# EAGLE schematic proto (EAGLE 6.6.0), part 1 of 2

## Sheet 1 of 3
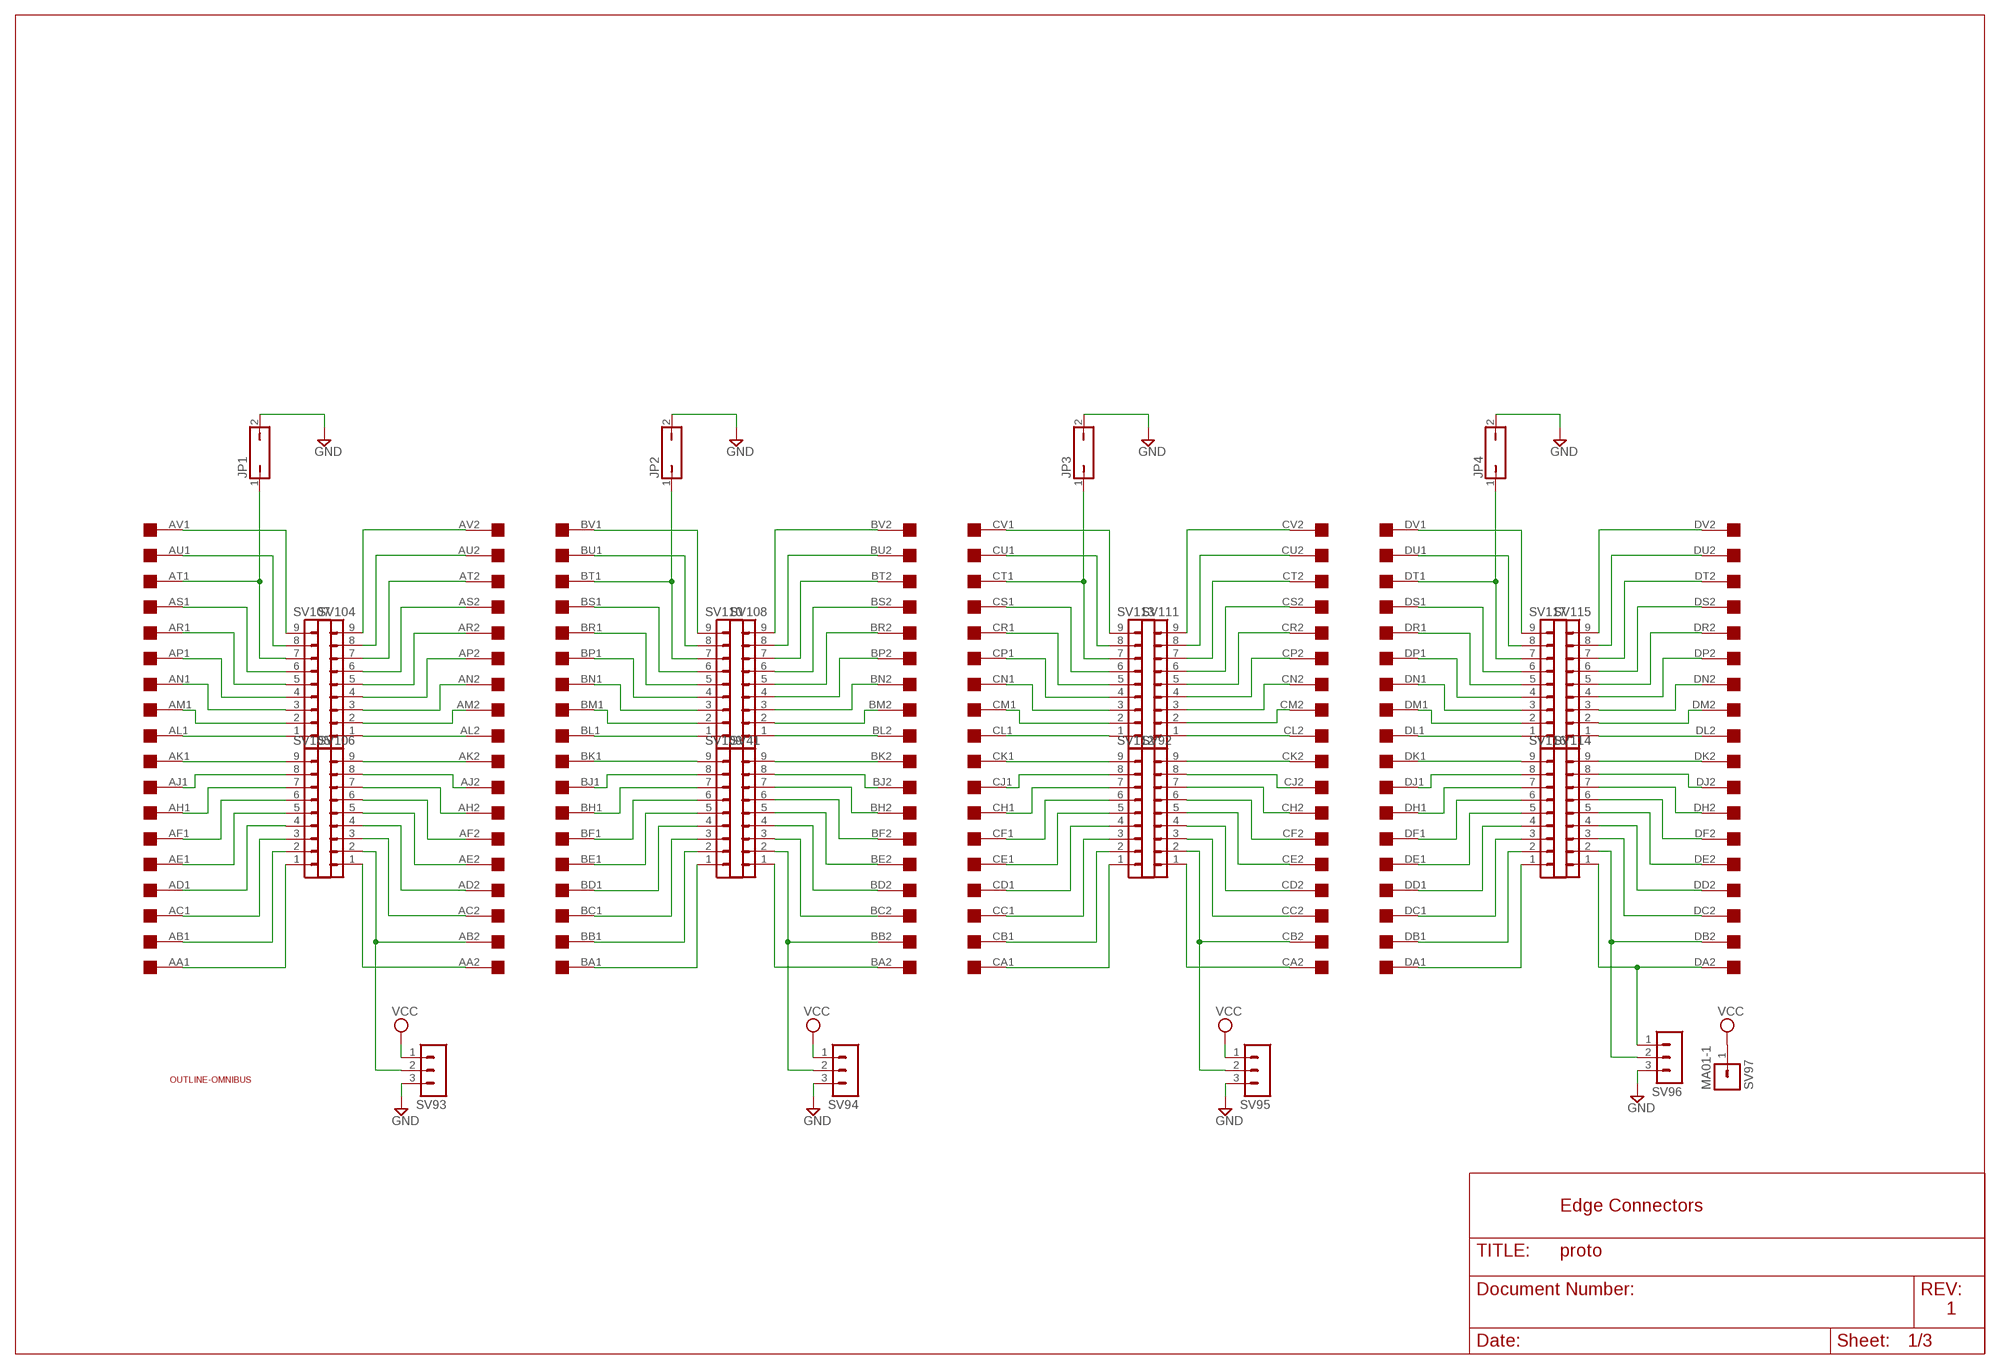
[diagram p0: schematic, sheet 1]

### Parts
JP1  JP1Q  [JP1]
JP2  JP1Q  [JP1]
JP3  JP1Q  [JP1]
JP4  JP1Q  [JP1]
SV41  MA09-1  [MA09-1]
SV92  MA09-1  [MA09-1]
SV93  MA03-1  [MA03-1]
SV94  MA03-1  [MA03-1]
SV95  MA03-1  [MA03-1]
SV96  MA03-1  [MA03-1]
SV97  MA01-1  [MA01-1]
SV104  MA09-1  [MA09-1]
SV105  MA09-1  [MA09-1]
SV106  MA09-1  [MA09-1]
SV107  MA09-1  [MA09-1]
SV108  MA09-1  [MA09-1]
SV109  MA09-1  [MA09-1]
SV110  MA09-1  [MA09-1]
SV111  MA09-1  [MA09-1]
SV112  MA09-1  [MA09-1]
SV113  MA09-1  [MA09-1]
SV114  MA09-1  [MA09-1]
SV115  MA09-1  [MA09-1]
SV116  MA09-1  [MA09-1]
SV117  MA09-1  [MA09-1]
U$1  OUTLINE-OMNIBUS  [OMNIBUS]
U$2  QUAD  [EDGE-CON8]

### Nets
GND [supply]: JP1.2 JP2.2 JP3.2 JP4.2 SV93.3 SV94.3 SV95.3 SV96.3 ; also sheet 2,3
N$46: SV106.1 U$2.AA2
N$47: SV93.2 SV106.2 U$2.AB2
N$48: SV109.9 U$2.BK1
N$49: SV41.9 U$2.BK2
N$50: SV112.9 U$2.CK1
N$51: SV41.1 U$2.BA2
N$52: SV116.9 U$2.DK1
N$53: SV112.1 U$2.CA1
N$54: SV116.1 U$2.DA1
N$1227: SV106.3 U$2.AC2
N$1228: SV104.9 U$2.AV2
N$1229: SV104.8 U$2.AU2
N$1230: SV104.7 U$2.AT2
N$1231: SV104.6 U$2.AS2
N$1232: SV104.5 U$2.AR2
N$1233: SV104.4 U$2.AP2
N$1234: SV106.4 U$2.AD2
N$1235: SV106.5 U$2.AE2
N$1236: SV106.6 U$2.AF2
N$1237: SV106.7 U$2.AH2
N$1238: SV104.3 U$2.AN2
N$1239: SV106.8 U$2.AJ2
N$1240: SV106.9 U$2.AK2
N$1241: SV104.1 U$2.AL2
N$1242: SV104.2 U$2.AM2
N$1243: SV105.1 U$2.AA1
N$1244: SV105.2 U$2.AB1
N$1245: SV105.3 U$2.AC1
N$1246: SV105.4 U$2.AD1
N$1247: SV105.5 U$2.AE1
N$1248: SV105.6 U$2.AF1
N$1249: SV105.7 U$2.AH1
N$1250: SV105.8 U$2.AJ1
N$1251: SV105.9 U$2.AK1
N$1252: SV107.1 U$2.AL1
N$1253: SV107.2 U$2.AM1
N$1254: SV107.3 U$2.AN1
N$1255: SV107.4 U$2.AP1
N$1256: SV107.5 U$2.AR1
N$1257: SV107.6 U$2.AS1
N$1258: JP1.1 SV107.7 U$2.AT1
N$1259: SV107.8 U$2.AU1
N$1260: SV107.9 U$2.AV1
N$1261: SV41.2 SV94.2 U$2.BB2
N$1262: SV41.3 U$2.BC2
N$1263: SV41.4 U$2.BD2
N$1264: SV41.5 U$2.BE2
N$1265: SV41.6 U$2.BF2
N$1266: SV41.7 U$2.BH2
N$1267: SV41.8 U$2.BJ2
N$1268: SV108.1 U$2.BL2
N$1269: SV108.2 U$2.BM2
N$1270: SV108.3 U$2.BN2
N$1271: SV108.4 U$2.BP2
N$1272: SV108.5 U$2.BR2
N$1273: SV108.6 U$2.BS2
N$1274: SV108.9 U$2.BV2
N$1275: SV108.8 U$2.BU2
N$1276: SV108.7 U$2.BT2
N$1277: SV109.1 U$2.BA1
N$1278: SV109.2 U$2.BB1
N$1279: SV109.3 U$2.BC1
N$1280: SV109.4 U$2.BD1
N$1281: SV109.5 U$2.BE1
N$1282: SV109.6 U$2.BF1
N$1283: SV109.7 U$2.BH1
N$1284: SV109.8 U$2.BJ1
N$1285: SV110.1 U$2.BL1
N$1286: SV110.2 U$2.BM1
N$1287: SV110.3 U$2.BN1
N$1288: SV110.4 U$2.BP1
N$1289: SV110.5 U$2.BR1
N$1290: SV110.6 U$2.BS1
N$1291: JP2.1 SV110.7 U$2.BT1
N$1292: SV110.8 U$2.BU1
N$1293: SV110.9 U$2.BV1
N$1294: SV116.2 U$2.DB1
N$1295: SV116.3 U$2.DC1
N$1296: SV116.4 U$2.DD1
N$1297: SV116.5 U$2.DE1
N$1298: SV116.6 U$2.DF1
N$1299: SV116.7 U$2.DH1
N$1300: SV116.8 U$2.DJ1
N$1301: SV117.1 U$2.DL1
N$1302: SV117.2 U$2.DM1
N$1303: SV117.3 U$2.DN1
N$1304: SV117.4 U$2.DP1
N$1305: SV117.5 U$2.DR1
N$1306: SV117.6 U$2.DS1
N$1307: JP4.1 SV117.7 U$2.DT1
N$1308: SV117.8 U$2.DU1
N$1309: SV117.9 U$2.DV1
N$1310: SV112.2 U$2.CB1
N$1311: SV112.3 U$2.CC1
N$1312: SV112.4 U$2.CD1
N$1313: SV112.5 U$2.CE1
N$1314: SV112.6 U$2.CF1
N$1315: SV112.7 U$2.CH1
N$1316: SV112.8 U$2.CJ1
N$1317: SV113.1 U$2.CL1
N$1318: SV113.2 U$2.CM1
N$1319: SV113.3 U$2.CN1
N$1320: SV113.4 U$2.CP1
N$1321: SV113.5 U$2.CR1
N$1322: SV113.6 U$2.CS1
N$1323: JP3.1 SV113.7 U$2.CT1
N$1324: SV113.8 U$2.CU1
N$1325: SV113.9 U$2.CV1
N$1326: SV92.1 U$2.CA2
N$1327: SV96.2 SV114.2 U$2.DB2
N$1328: SV92.3 U$2.CC2
N$1329: SV92.4 U$2.CD2
N$1330: SV92.5 U$2.CE2
N$1331: SV92.6 U$2.CF2
N$1332: SV92.7 U$2.CH2
N$1333: SV92.8 U$2.CJ2
N$1334: SV92.9 U$2.CK2
N$1335: SV114.9 U$2.DK2
N$1336: SV111.1 U$2.CL2
N$1337: SV111.2 U$2.CM2
N$1338: SV111.3 U$2.CN2
N$1339: SV111.4 U$2.CP2
N$1340: SV111.5 U$2.CR2
N$1341: SV111.6 U$2.CS2
N$1342: SV111.7 U$2.CT2
N$1343: SV111.8 U$2.CU2
N$1344: SV111.9 U$2.CV2
N$1345: SV115.9 U$2.DV2
N$1346: SV96.1 SV114.1 U$2.DA2
N$1348: SV114.3 U$2.DC2
N$1349: SV114.4 U$2.DD2
N$1350: SV114.5 U$2.DE2
N$1351: SV114.6 U$2.DF2
N$1352: SV114.7 U$2.DH2
N$1353: SV114.8 U$2.DJ2
N$1354: SV115.1 U$2.DL2
N$1355: SV115.2 U$2.DM2
N$1356: SV115.3 U$2.DN2
N$1357: SV115.4 U$2.DP2
N$1358: SV115.5 U$2.DR2
N$1359: SV115.6 U$2.DS2
N$1360: SV115.7 U$2.DT2
N$1361: SV115.8 U$2.DU2
N$1362: SV92.2 SV95.2 U$2.CB2
VCC [supply]: SV93.1 SV94.1 SV95.1 SV97.1 ; also sheet 2,3

### Notes on the sheet
- Edge Connectors
- 1

## Sheet 2 of 3
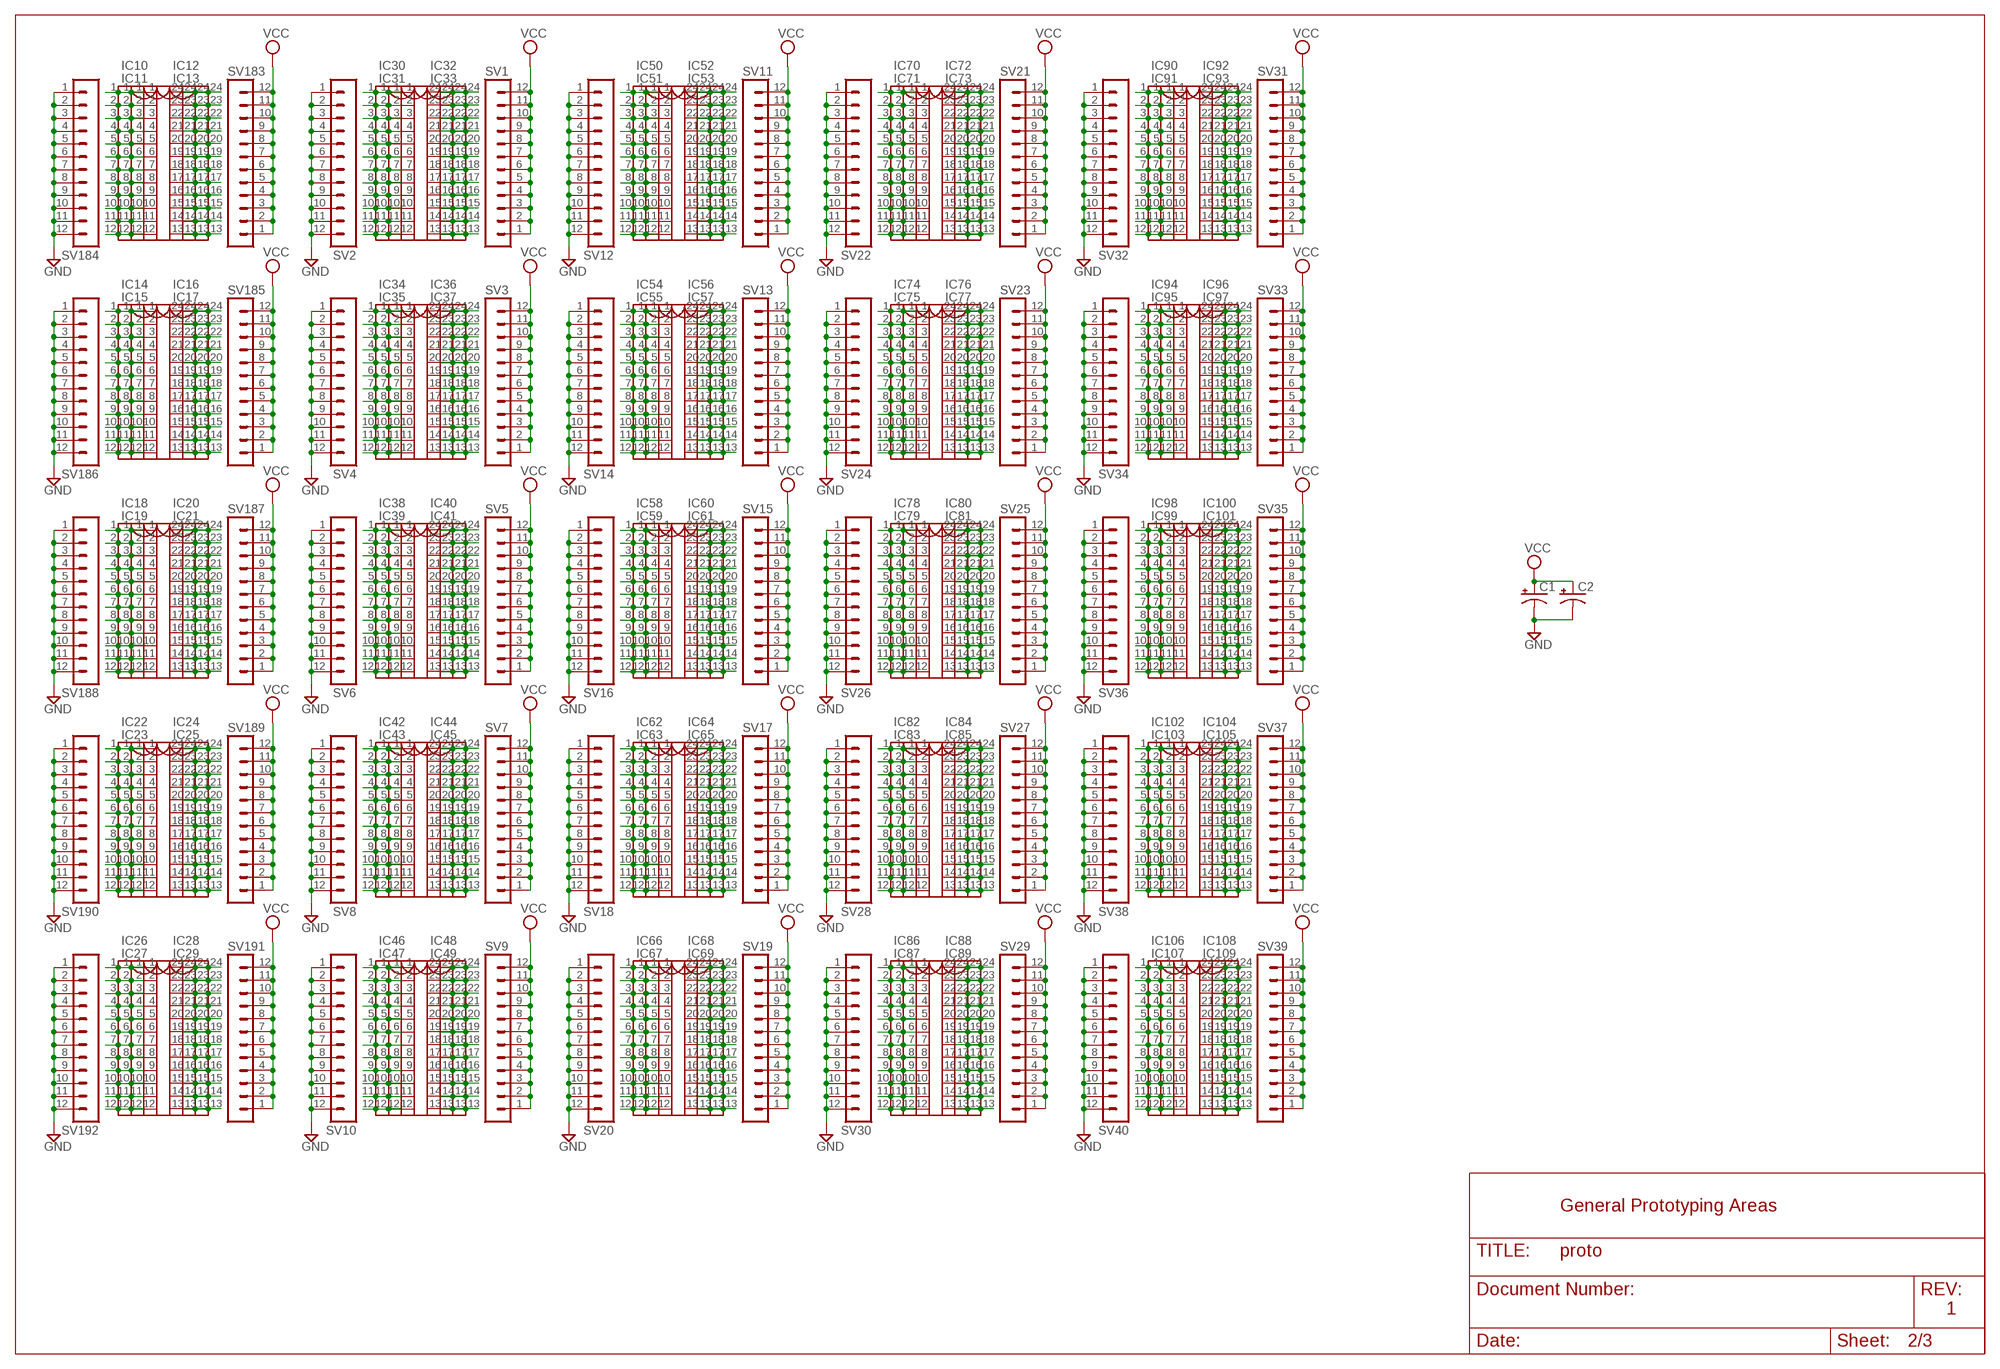
[diagram p1: schematic, sheet 2]

### Parts
C1  CPOL-USE20-8AXIAL  [E12-8]
C2  CPOL-USE20-8AXIAL  [E12-8]
IC10  DIL24-3  [DIL24-3]
IC11  DIL24-6  [DIL24-6]
IC12  DIL24-9  [DIL24-9]
IC13  DIL24-6  [DIL24-6]
IC14  DIL24-3  [DIL24-3]
IC15  DIL24-6  [DIL24-6]
IC16  DIL24-9  [DIL24-9]
IC17  DIL24-6  [DIL24-6]
IC18  DIL24-3  [DIL24-3]
IC19  DIL24-6  [DIL24-6]
IC20  DIL24-9  [DIL24-9]
IC21  DIL24-6  [DIL24-6]
IC22  DIL24-3  [DIL24-3]
IC23  DIL24-6  [DIL24-6]
IC24  DIL24-9  [DIL24-9]
IC25  DIL24-6  [DIL24-6]
IC26  DIL24-3  [DIL24-3]
IC27  DIL24-6  [DIL24-6]
IC28  DIL24-9  [DIL24-9]
IC29  DIL24-6  [DIL24-6]
IC30  DIL24-3  [DIL24-3]
IC31  DIL24-6  [DIL24-6]
IC32  DIL24-9  [DIL24-9]
IC33  DIL24-6  [DIL24-6]
IC34  DIL24-3  [DIL24-3]
IC35  DIL24-6  [DIL24-6]
IC36  DIL24-9  [DIL24-9]
IC37  DIL24-6  [DIL24-6]
IC38  DIL24-3  [DIL24-3]
IC39  DIL24-6  [DIL24-6]
IC40  DIL24-9  [DIL24-9]
IC41  DIL24-6  [DIL24-6]
IC42  DIL24-3  [DIL24-3]
IC43  DIL24-6  [DIL24-6]
IC44  DIL24-9  [DIL24-9]
IC45  DIL24-6  [DIL24-6]
IC46  DIL24-3  [DIL24-3]
IC47  DIL24-6  [DIL24-6]
IC48  DIL24-9  [DIL24-9]
IC49  DIL24-6  [DIL24-6]
IC50  DIL24-3  [DIL24-3]
IC51  DIL24-6  [DIL24-6]
IC52  DIL24-9  [DIL24-9]
IC53  DIL24-6  [DIL24-6]
IC54  DIL24-3  [DIL24-3]
IC55  DIL24-6  [DIL24-6]
IC56  DIL24-9  [DIL24-9]
IC57  DIL24-6  [DIL24-6]
IC58  DIL24-3  [DIL24-3]
IC59  DIL24-6  [DIL24-6]
IC60  DIL24-9  [DIL24-9]
IC61  DIL24-6  [DIL24-6]
IC62  DIL24-3  [DIL24-3]
IC63  DIL24-6  [DIL24-6]
IC64  DIL24-9  [DIL24-9]
IC65  DIL24-6  [DIL24-6]
IC66  DIL24-3  [DIL24-3]
IC67  DIL24-6  [DIL24-6]
IC68  DIL24-9  [DIL24-9]
IC69  DIL24-6  [DIL24-6]
IC70  DIL24-3  [DIL24-3]
IC71  DIL24-6  [DIL24-6]
IC72  DIL24-9  [DIL24-9]
IC73  DIL24-6  [DIL24-6]
IC74  DIL24-3  [DIL24-3]
IC75  DIL24-6  [DIL24-6]
IC76  DIL24-9  [DIL24-9]
IC77  DIL24-6  [DIL24-6]
IC78  DIL24-3  [DIL24-3]
IC79  DIL24-6  [DIL24-6]
IC80  DIL24-9  [DIL24-9]
IC81  DIL24-6  [DIL24-6]
IC82  DIL24-3  [DIL24-3]
IC83  DIL24-6  [DIL24-6]
IC84  DIL24-9  [DIL24-9]
IC85  DIL24-6  [DIL24-6]
IC86  DIL24-3  [DIL24-3]
IC87  DIL24-6  [DIL24-6]
IC88  DIL24-9  [DIL24-9]
IC89  DIL24-6  [DIL24-6]
IC90  DIL24-3  [DIL24-3]
IC91  DIL24-6  [DIL24-6]
IC92  DIL24-9  [DIL24-9]
IC93  DIL24-6  [DIL24-6]
IC94  DIL24-3  [DIL24-3]
IC95  DIL24-6  [DIL24-6]
IC96  DIL24-9  [DIL24-9]
IC97  DIL24-6  [DIL24-6]
IC98  DIL24-3  [DIL24-3]
IC99  DIL24-6  [DIL24-6]
IC100  DIL24-9  [DIL24-9]
IC101  DIL24-6  [DIL24-6]
IC102  DIL24-3  [DIL24-3]
IC103  DIL24-6  [DIL24-6]
IC104  DIL24-9  [DIL24-9]
IC105  DIL24-6  [DIL24-6]
IC106  DIL24-3  [DIL24-3]
IC107  DIL24-6  [DIL24-6]
IC108  DIL24-9  [DIL24-9]
IC109  DIL24-6  [DIL24-6]
SV1  MA12-1  [MA12-1]
SV2  MA12-1  [MA12-1]
SV3  MA12-1  [MA12-1]
SV4  MA12-1  [MA12-1]
SV5  MA12-1  [MA12-1]
SV6  MA12-1  [MA12-1]
SV7  MA12-1  [MA12-1]
SV8  MA12-1  [MA12-1]
SV9  MA12-1  [MA12-1]
SV10  MA12-1  [MA12-1]
SV11  MA12-1  [MA12-1]
SV12  MA12-1  [MA12-1]
SV13  MA12-1  [MA12-1]
SV14  MA12-1  [MA12-1]
SV15  MA12-1  [MA12-1]
SV16  MA12-1  [MA12-1]
SV17  MA12-1  [MA12-1]
SV18  MA12-1  [MA12-1]
SV19  MA12-1  [MA12-1]
SV20  MA12-1  [MA12-1]
SV21  MA12-1  [MA12-1]
SV22  MA12-1  [MA12-1]
SV23  MA12-1  [MA12-1]
SV24  MA12-1  [MA12-1]
SV25  MA12-1  [MA12-1]
SV26  MA12-1  [MA12-1]
SV27  MA12-1  [MA12-1]
SV28  MA12-1  [MA12-1]
SV29  MA12-1  [MA12-1]
SV30  MA12-1  [MA12-1]
SV31  MA12-1  [MA12-1]
SV32  MA12-1  [MA12-1]
SV33  MA12-1  [MA12-1]
SV34  MA12-1  [MA12-1]
SV35  MA12-1  [MA12-1]
SV36  MA12-1  [MA12-1]
SV37  MA12-1  [MA12-1]
SV38  MA12-1  [MA12-1]
SV39  MA12-1  [MA12-1]
SV40  MA12-1  [MA12-1]
SV183  MA12-1  [MA12-1]
SV184  MA12-1  [MA12-1]
SV185  MA12-1  [MA12-1]
SV186  MA12-1  [MA12-1]
SV187  MA12-1  [MA12-1]
SV188  MA12-1  [MA12-1]
SV189  MA12-1  [MA12-1]
SV190  MA12-1  [MA12-1]
SV191  MA12-1  [MA12-1]
SV192  MA12-1  [MA12-1]

### Nets
GND [supply]: C1.- C2.- SV2.1 SV2.2 SV2.3 SV2.4 SV2.5 SV2.6 SV2.7 SV2.8 SV2.9 SV2.10 SV2.11 SV2.12 SV4.1 SV4.2 SV4.3 SV4.4 SV4.5 SV4.6 SV4.7 SV4.8 SV4.9 SV4.10 SV4.11 SV4.12 SV6.1 SV6.2 SV6.3 SV6.4 SV6.5 SV6.6 SV6.7 SV6.8 SV6.9 SV6.10 SV6.11 SV6.12 SV8.1 SV8.2 SV8.3 SV8.4 SV8.5 SV8.6 SV8.7 SV8.8 SV8.9 SV8.10 SV8.11 SV8.12 SV10.1 SV10.2 SV10.3 SV10.4 SV10.5 SV10.6 SV10.7 SV10.8 SV10.9 SV10.10 SV10.11 SV10.12 SV12.1 SV12.2 SV12.3 SV12.4 SV12.5 SV12.6 SV12.7 SV12.8 SV12.9 SV12.10 SV12.11 SV12.12 SV14.1 SV14.2 SV14.3 SV14.4 SV14.5 SV14.6 SV14.7 SV14.8 SV14.9 SV14.10 SV14.11 SV14.12 SV16.1 SV16.2 SV16.3 SV16.4 SV16.5 SV16.6 SV16.7 SV16.8 SV16.9 SV16.10 SV16.11 SV16.12 SV18.1 SV18.2 SV18.3 SV18.4 SV18.5 SV18.6 SV18.7 SV18.8 SV18.9 SV18.10 SV18.11 SV18.12 SV20.1 SV20.2 SV20.3 SV20.4 SV20.5 SV20.6 SV20.7 SV20.8 SV20.9 SV20.10 SV20.11 SV20.12 SV22.1 SV22.2 SV22.3 SV22.4 SV22.5 SV22.6 SV22.7 SV22.8 SV22.9 SV22.10 SV22.11 SV22.12 SV24.1 SV24.2 SV24.3 SV24.4 SV24.5 SV24.6 SV24.7 SV24.8 SV24.9 SV24.10 SV24.11 SV24.12 SV26.1 SV26.2 SV26.3 SV26.4 SV26.5 SV26.6 SV26.7 SV26.8 SV26.9 SV26.10 SV26.11 SV26.12 SV28.1 SV28.2 SV28.3 SV28.4 SV28.5 SV28.6 SV28.7 SV28.8 SV28.9 SV28.10 SV28.11 SV28.12 SV30.1 SV30.2 SV30.3 SV30.4 SV30.5 SV30.6 SV30.7 SV30.8 SV30.9 SV30.10 SV30.11 SV30.12 SV32.1 SV32.2 SV32.3 SV32.4 SV32.5 SV32.6 SV32.7 SV32.8 SV32.9 SV32.10 SV32.11 SV32.12 SV34.1 SV34.2 SV34.3 SV34.4 SV34.5 SV34.6 SV34.7 SV34.8 SV34.9 SV34.10 SV34.11 SV34.12 SV36.1 SV36.2 SV36.3 SV36.4 SV36.5 SV36.6 SV36.7 SV36.8 SV36.9 SV36.10 SV36.11 SV36.12 SV38.1 SV38.2 SV38.3 SV38.4 SV38.5 SV38.6 SV38.7 SV38.8 SV38.9 SV38.10 SV38.11 SV38.12 SV40.1 SV40.2 SV40.3 SV40.4 SV40.5 SV40.6 SV40.7 SV40.8 SV40.9 SV40.10 SV40.11 SV40.12 SV184.1 SV184.2 SV184.3 SV184.4 SV184.5 SV184.6 SV184.7 SV184.8 SV184.9 SV184.10 SV184.11 SV184.12 SV186.1 SV186.2 SV186.3 SV186.4 SV186.5 SV186.6 SV186.7 SV186.8 SV186.9 SV186.10 SV186.11 SV186.12 SV188.1 SV188.2 SV188.3 SV188.4 SV188.5 SV188.6 SV188.7 SV188.8 SV188.9 SV188.10 SV188.11 SV188.12 SV190.1 SV190.2 SV190.3 SV190.4 SV190.5 SV190.6 SV190.7 SV190.8 SV190.9 SV190.10 SV190.11 SV190.12 SV192.1 SV192.2 SV192.3 SV192.4 SV192.5 SV192.6 SV192.7 SV192.8 SV192.9 SV192.10 SV192.11 SV192.12 ; also sheet 1,3
N$34: IC30.1 IC31.1 IC32.1 IC33.1
N$40: IC30.2 IC31.2 IC32.2 IC33.2
N$41: IC30.3 IC31.3 IC32.3 IC33.3
N$42: IC30.4 IC31.4 IC32.4 IC33.4
N$43: IC30.5 IC31.5 IC32.5 IC33.5
N$44: IC30.6 IC31.6 IC32.6 IC33.6
N$45: IC30.7 IC31.7 IC32.7 IC33.7
N$55: IC10.1 IC11.1 IC12.1 IC13.1
N$56: IC10.2 IC11.2 IC12.2 IC13.2
N$57: IC10.3 IC11.3 IC12.3 IC13.3
N$58: IC10.4 IC11.4 IC12.4 IC13.4
N$59: IC10.5 IC11.5 IC12.5 IC13.5
N$60: IC10.6 IC11.6 IC12.6 IC13.6
N$61: IC10.7 IC11.7 IC12.7 IC13.7
N$62: IC10.8 IC11.8 IC12.8 IC13.8
N$63: IC10.9 IC11.9 IC12.9 IC13.9
N$64: IC10.10 IC11.10 IC12.10 IC13.10
N$65: IC10.11 IC11.11 IC12.11 IC13.11
N$66: IC10.12 IC11.12 IC12.12 IC13.12
N$67: IC10.13 IC11.13 IC12.13 IC13.13
N$68: IC10.14 IC11.14 IC12.14 IC13.14
N$69: IC10.15 IC11.15 IC12.15 IC13.15
N$70: IC10.16 IC11.16 IC12.16 IC13.16
N$71: IC10.17 IC11.17 IC12.17 IC13.17
N$72: IC10.18 IC11.18 IC12.18 IC13.18
N$73: IC10.19 IC11.19 IC12.19 IC13.19
N$74: IC10.20 IC11.20 IC12.20 IC13.20
N$75: IC10.21 IC11.21 IC12.21 IC13.21
N$76: IC10.22 IC11.22 IC12.22 IC13.22
N$77: IC10.23 IC11.23 IC12.23 IC13.23
N$78: IC10.24 IC11.24 IC12.24 IC13.24
N$79: IC14.1 IC15.1 IC16.1 IC17.1
N$80: IC14.2 IC15.2 IC16.2 IC17.2
N$81: IC14.3 IC15.3 IC16.3 IC17.3
N$82: IC14.4 IC15.4 IC16.4 IC17.4
N$83: IC14.5 IC15.5 IC16.5 IC17.5
N$84: IC14.6 IC15.6 IC16.6 IC17.6
N$85: IC14.7 IC15.7 IC16.7 IC17.7
N$86: IC14.8 IC15.8 IC16.8 IC17.8
N$87: IC14.9 IC15.9 IC16.9 IC17.9
N$88: IC14.10 IC15.10 IC16.10 IC17.10
N$89: IC14.11 IC15.11 IC16.11 IC17.11
N$90: IC14.12 IC15.12 IC16.12 IC17.12
N$91: IC14.13 IC15.13 IC16.13 IC17.13
N$92: IC14.14 IC15.14 IC16.14 IC17.14
N$93: IC14.15 IC15.15 IC16.15 IC17.15
N$94: IC14.16 IC15.16 IC16.16 IC17.16
N$95: IC14.17 IC15.17 IC16.17 IC17.17
N$96: IC14.18 IC15.18 IC16.18 IC17.18
N$97: IC14.19 IC15.19 IC16.19 IC17.19
N$98: IC14.20 IC15.20 IC16.20 IC17.20
N$99: IC14.21 IC15.21 IC16.21 IC17.21
N$100: IC14.22 IC15.22 IC16.22 IC17.22
N$101: IC14.23 IC15.23 IC16.23 IC17.23
N$102: IC14.24 IC15.24 IC16.24 IC17.24
N$103: IC18.1 IC19.1 IC20.1 IC21.1
N$104: IC18.2 IC19.2 IC20.2 IC21.2
N$105: IC18.3 IC19.3 IC20.3 IC21.3
N$106: IC18.4 IC19.4 IC20.4 IC21.4
N$107: IC18.5 IC19.5 IC20.5 IC21.5
N$108: IC18.6 IC19.6 IC20.6 IC21.6
N$109: IC18.7 IC19.7 IC20.7 IC21.7
N$110: IC18.8 IC19.8 IC20.8 IC21.8
N$111: IC18.9 IC19.9 IC20.9 IC21.9
N$112: IC18.10 IC19.10 IC20.10 IC21.10
N$113: IC18.11 IC19.11 IC20.11 IC21.11
N$114: IC18.12 IC19.12 IC20.12 IC21.12
N$115: IC18.13 IC19.13 IC20.13 IC21.13
N$116: IC18.14 IC19.14 IC20.14 IC21.14
N$117: IC18.15 IC19.15 IC20.15 IC21.15
N$118: IC18.16 IC19.16 IC20.16 IC21.16
N$119: IC18.17 IC19.17 IC20.17 IC21.17
N$120: IC18.18 IC19.18 IC20.18 IC21.18
N$121: IC18.19 IC19.19 IC20.19 IC21.19
N$122: IC18.20 IC19.20 IC20.20 IC21.20
N$123: IC18.21 IC19.21 IC20.21 IC21.21
N$124: IC18.22 IC19.22 IC20.22 IC21.22
N$125: IC18.23 IC19.23 IC20.23 IC21.23
N$126: IC18.24 IC19.24 IC20.24 IC21.24
N$127: IC22.1 IC23.1 IC24.1 IC25.1
N$128: IC22.2 IC23.2 IC24.2 IC25.2
N$129: IC22.3 IC23.3 IC24.3 IC25.3
N$130: IC22.4 IC23.4 IC24.4 IC25.4
N$131: IC22.5 IC23.5 IC24.5 IC25.5
N$132: IC22.6 IC23.6 IC24.6 IC25.6
N$133: IC22.7 IC23.7 IC24.7 IC25.7
N$134: IC22.8 IC23.8 IC24.8 IC25.8
N$135: IC22.9 IC23.9 IC24.9 IC25.9
N$136: IC22.10 IC23.10 IC24.10 IC25.10
N$137: IC22.11 IC23.11 IC24.11 IC25.11
N$138: IC22.12 IC23.12 IC24.12 IC25.12
N$139: IC22.13 IC23.13 IC24.13 IC25.13
N$140: IC22.14 IC23.14 IC24.14 IC25.14
N$141: IC22.15 IC23.15 IC24.15 IC25.15
N$142: IC22.16 IC23.16 IC24.16 IC25.16
N$143: IC22.17 IC23.17 IC24.17 IC25.17
N$144: IC22.18 IC23.18 IC24.18 IC25.18
N$145: IC22.19 IC23.19 IC24.19 IC25.19
N$146: IC22.20 IC23.20 IC24.20 IC25.20
N$147: IC22.21 IC23.21 IC24.21 IC25.21
N$148: IC22.22 IC23.22 IC24.22 IC25.22
N$149: IC22.23 IC23.23 IC24.23 IC25.23
N$150: IC22.24 IC23.24 IC24.24 IC25.24
N$151: IC26.1 IC27.1 IC28.1 IC29.1
N$152: IC26.2 IC27.2 IC28.2 IC29.2
N$153: IC26.3 IC27.3 IC28.3 IC29.3
N$154: IC26.4 IC27.4 IC28.4 IC29.4
N$155: IC26.5 IC27.5 IC28.5 IC29.5
N$156: IC26.6 IC27.6 IC28.6 IC29.6
N$157: IC26.7 IC27.7 IC28.7 IC29.7
N$158: IC26.8 IC27.8 IC28.8 IC29.8
N$159: IC26.9 IC27.9 IC28.9 IC29.9
N$160: IC26.10 IC27.10 IC28.10 IC29.10
N$161: IC26.11 IC27.11 IC28.11 IC29.11
N$162: IC26.12 IC27.12 IC28.12 IC29.12
N$163: IC26.13 IC27.13 IC28.13 IC29.13
N$164: IC26.14 IC27.14 IC28.14 IC29.14
N$165: IC26.15 IC27.15 IC28.15 IC29.15
N$166: IC26.16 IC27.16 IC28.16 IC29.16
N$167: IC26.17 IC27.17 IC28.17 IC29.17
N$168: IC26.18 IC27.18 IC28.18 IC29.18
N$169: IC26.19 IC27.19 IC28.19 IC29.19
N$170: IC26.20 IC27.20 IC28.20 IC29.20
N$171: IC26.21 IC27.21 IC28.21 IC29.21
N$172: IC26.22 IC27.22 IC28.22 IC29.22
N$173: IC26.23 IC27.23 IC28.23 IC29.23
N$174: IC26.24 IC27.24 IC28.24 IC29.24
N$175: IC30.8 IC31.8 IC32.8 IC33.8
N$176: IC30.9 IC31.9 IC32.9 IC33.9
N$177: IC30.10 IC31.10 IC32.10 IC33.10
N$178: IC30.11 IC31.11 IC32.11 IC33.11
N$179: IC30.12 IC31.12 IC32.12 IC33.12
N$180: IC30.13 IC31.13 IC32.13 IC33.13
N$181: IC30.14 IC31.14 IC32.14 IC33.14
N$182: IC30.15 IC31.15 IC32.15 IC33.15
N$183: IC30.16 IC31.16 IC32.16 IC33.16
N$184: IC30.17 IC31.17 IC32.17 IC33.17
N$185: IC30.18 IC31.18 IC32.18 IC33.18
N$186: IC30.19 IC31.19 IC32.19 IC33.19
N$187: IC30.20 IC31.20 IC32.20 IC33.20
N$188: IC30.21 IC31.21 IC32.21 IC33.21
N$189: IC30.22 IC31.22 IC32.22 IC33.22
N$190: IC30.23 IC31.23 IC32.23 IC33.23
N$191: IC30.24 IC31.24 IC32.24 IC33.24
N$192: IC34.1 IC35.1 IC36.1 IC37.1
N$193: IC34.2 IC35.2 IC36.2 IC37.2
N$194: IC34.3 IC35.3 IC36.3 IC37.3
N$195: IC34.4 IC35.4 IC36.4 IC37.4
N$196: IC34.5 IC35.5 IC36.5 IC37.5
N$197: IC34.6 IC35.6 IC36.6 IC37.6
N$198: IC34.7 IC35.7 IC36.7 IC37.7
N$199: IC34.8 IC35.8 IC36.8 IC37.8
N$200: IC34.9 IC35.9 IC36.9 IC37.9
N$201: IC34.10 IC35.10 IC36.10 IC37.10
N$202: IC34.11 IC35.11 IC36.11 IC37.11
N$203: IC34.12 IC35.12 IC36.12 IC37.12
N$204: IC34.13 IC35.13 IC36.13 IC37.13
N$205: IC34.14 IC35.14 IC36.14 IC37.14
N$206: IC34.15 IC35.15 IC36.15 IC37.15
N$207: IC34.16 IC35.16 IC36.16 IC37.16
N$208: IC34.17 IC35.17 IC36.17 IC37.17
N$209: IC34.18 IC35.18 IC36.18 IC37.18
N$210: IC34.19 IC35.19 IC36.19 IC37.19
N$211: IC34.20 IC35.20 IC36.20 IC37.20
N$212: IC34.21 IC35.21 IC36.21 IC37.21
N$213: IC34.22 IC35.22 IC36.22 IC37.22
N$214: IC34.23 IC35.23 IC36.23 IC37.23
N$215: IC34.24 IC35.24 IC36.24 IC37.24
N$216: IC38.1 IC39.1 IC40.1 IC41.1
N$217: IC38.2 IC39.2 IC40.2 IC41.2
N$218: IC38.3 IC39.3 IC40.3 IC41.3
N$219: IC38.4 IC39.4 IC40.4 IC41.4
N$220: IC38.5 IC39.5 IC40.5 IC41.5
N$221: IC38.6 IC39.6 IC40.6 IC41.6
N$222: IC38.7 IC39.7 IC40.7 IC41.7
N$223: IC38.8 IC39.8 IC40.8 IC41.8
N$224: IC38.9 IC39.9 IC40.9 IC41.9
N$225: IC38.10 IC39.10 IC40.10 IC41.10
N$226: IC38.11 IC39.11 IC40.11 IC41.11
N$227: IC38.12 IC39.12 IC40.12 IC41.12
N$228: IC38.13 IC39.13 IC40.13 IC41.13
N$229: IC38.14 IC39.14 IC40.14 IC41.14
N$230: IC38.15 IC39.15 IC40.15 IC41.15
N$231: IC38.16 IC39.16 IC40.16 IC41.16
N$232: IC38.17 IC39.17 IC40.17 IC41.17
N$233: IC38.18 IC39.18 IC40.18 IC41.18
N$234: IC38.19 IC39.19 IC40.19 IC41.19
N$235: IC38.20 IC39.20 IC40.20 IC41.20
N$236: IC38.21 IC39.21 IC40.21 IC41.21
N$237: IC38.22 IC39.22 IC40.22 IC41.22
N$238: IC38.23 IC39.23 IC40.23 IC41.23
N$239: IC38.24 IC39.24 IC40.24 IC41.24
N$240: IC42.1 IC43.1 IC44.1 IC45.1
N$241: IC42.2 IC43.2 IC44.2 IC45.2
N$242: IC42.3 IC43.3 IC44.3 IC45.3
N$243: IC42.4 IC43.4 IC44.4 IC45.4
N$244: IC42.5 IC43.5 IC44.5 IC45.5
N$245: IC42.6 IC43.6 IC44.6 IC45.6
N$246: IC42.7 IC43.7 IC44.7 IC45.7
N$247: IC42.8 IC43.8 IC44.8 IC45.8
N$248: IC42.9 IC43.9 IC44.9 IC45.9
N$249: IC42.10 IC43.10 IC44.10 IC45.10
N$250: IC42.11 IC43.11 IC44.11 IC45.11
N$251: IC42.12 IC43.12 IC44.12 IC45.12
N$252: IC42.13 IC43.13 IC44.13 IC45.13
N$253: IC42.14 IC43.14 IC44.14 IC45.14
N$254: IC42.15 IC43.15 IC44.15 IC45.15
N$255: IC42.16 IC43.16 IC44.16 IC45.16
N$256: IC42.17 IC43.17 IC44.17 IC45.17
N$257: IC42.18 IC43.18 IC44.18 IC45.18
N$258: IC42.19 IC43.19 IC44.19 IC45.19
N$259: IC42.20 IC43.20 IC44.20 IC45.20
N$260: IC42.21 IC43.21 IC44.21 IC45.21
N$261: IC42.22 IC43.22 IC44.22 IC45.22
N$262: IC42.23 IC43.23 IC44.23 IC45.23
N$263: IC42.24 IC43.24 IC44.24 IC45.24
N$264: IC46.1 IC47.1 IC48.1 IC49.1
N$265: IC46.2 IC47.2 IC48.2 IC49.2
N$266: IC46.3 IC47.3 IC48.3 IC49.3
N$267: IC46.4 IC47.4 IC48.4 IC49.4
N$268: IC46.5 IC47.5 IC48.5 IC49.5
N$269: IC46.6 IC47.6 IC48.6 IC49.6
N$270: IC46.7 IC47.7 IC48.7 IC49.7
N$271: IC46.8 IC47.8 IC48.8 IC49.8
N$272: IC46.9 IC47.9 IC48.9 IC49.9
N$273: IC46.10 IC47.10 IC48.10 IC49.10
N$274: IC46.11 IC47.11 IC48.11 IC49.11
N$275: IC46.12 IC47.12 IC48.12 IC49.12
N$276: IC46.13 IC47.13 IC48.13 IC49.13
N$277: IC46.14 IC47.14 IC48.14 IC49.14
N$278: IC46.15 IC47.15 IC48.15 IC49.15
N$279: IC46.16 IC47.16 IC48.16 IC49.16
N$280: IC46.17 IC47.17 IC48.17 IC49.17
N$281: IC46.18 IC47.18 IC48.18 IC49.18
N$282: IC46.19 IC47.19 IC48.19 IC49.19
N$283: IC46.20 IC47.20 IC48.20 IC49.20
N$284: IC46.21 IC47.21 IC48.21 IC49.21
N$285: IC46.22 IC47.22 IC48.22 IC49.22
N$286: IC46.23 IC47.23 IC48.23 IC49.23
N$287: IC46.24 IC47.24 IC48.24 IC49.24
N$288: IC50.1 IC51.1 IC52.1 IC53.1
N$289: IC50.2 IC51.2 IC52.2 IC53.2
N$290: IC50.3 IC51.3 IC52.3 IC53.3
N$291: IC50.4 IC51.4 IC52.4 IC53.4
N$292: IC50.5 IC51.5 IC52.5 IC53.5
N$293: IC50.6 IC51.6 IC52.6 IC53.6
N$294: IC50.7 IC51.7 IC52.7 IC53.7
N$295: IC50.8 IC51.8 IC52.8 IC53.8
N$296: IC50.9 IC51.9 IC52.9 IC53.9
N$297: IC50.10 IC51.10 IC52.10 IC53.10
N$298: IC50.11 IC51.11 IC52.11 IC53.11
N$299: IC50.12 IC51.12 IC52.12 IC53.12
N$300: IC50.13 IC51.13 IC52.13 IC53.13
N$301: IC50.14 IC51.14 IC52.14 IC53.14
N$302: IC50.15 IC51.15 IC52.15 IC53.15
N$303: IC50.16 IC51.16 IC52.16 IC53.16
N$304: IC50.17 IC51.17 IC52.17 IC53.17
N$305: IC50.18 IC51.18 IC52.18 IC53.18
N$306: IC50.19 IC51.19 IC52.19 IC53.19
N$307: IC50.20 IC51.20 IC52.20 IC53.20
N$308: IC50.21 IC51.21 IC52.21 IC53.21
N$309: IC50.22 IC51.22 IC52.22 IC53.22
N$310: IC50.23 IC51.23 IC52.23 IC53.23
N$311: IC50.24 IC51.24 IC52.24 IC53.24
N$312: IC54.1 IC55.1 IC56.1 IC57.1
N$313: IC54.2 IC55.2 IC56.2 IC57.2
N$314: IC54.3 IC55.3 IC56.3 IC57.3
N$315: IC54.4 IC55.4 IC56.4 IC57.4
N$316: IC54.5 IC55.5 IC56.5 IC57.5
N$317: IC54.6 IC55.6 IC56.6 IC57.6
N$318: IC54.7 IC55.7 IC56.7 IC57.7
N$319: IC54.8 IC55.8 IC56.8 IC57.8
N$320: IC54.9 IC55.9 IC56.9 IC57.9
N$321: IC54.10 IC55.10 IC56.10 IC57.10
N$322: IC54.11 IC55.11 IC56.11 IC57.11
N$323: IC54.12 IC55.12 IC56.12 IC57.12
N$324: IC54.13 IC55.13 IC56.13 IC57.13
N$325: IC54.14 IC55.14 IC56.14 IC57.14
N$326: IC54.15 IC55.15 IC56.15 IC57.15
N$327: IC54.16 IC55.16 IC56.16 IC57.16
N$328: IC54.17 IC55.17 IC56.17 IC57.17
N$329: IC54.18 IC55.18 IC56.18 IC57.18
N$330: IC54.19 IC55.19 IC56.19 IC57.19
N$331: IC54.20 IC55.20 IC56.20 IC57.20
N$332: IC54.21 IC55.21 IC56.21 IC57.21
N$333: IC54.22 IC55.22 IC56.22 IC57.22
N$334: IC54.23 IC55.23 IC56.23 IC57.23
N$335: IC54.24 IC55.24 IC56.24 IC57.24
N$336: IC58.1 IC59.1 IC60.1 IC61.1
N$337: IC58.2 IC59.2 IC60.2 IC61.2
N$338: IC58.3 IC59.3 IC60.3 IC61.3
N$339: IC58.4 IC59.4 IC60.4 IC61.4
N$340: IC58.5 IC59.5 IC60.5 IC61.5
N$341: IC58.6 IC59.6 IC60.6 IC61.6
N$342: IC58.7 IC59.7 IC60.7 IC61.7
N$343: IC58.8 IC59.8 IC60.8 IC61.8
N$344: IC58.9 IC59.9 IC60.9 IC61.9
N$345: IC58.10 IC59.10 IC60.10 IC61.10
N$346: IC58.11 IC59.11 IC60.11 IC61.11
N$347: IC58.12 IC59.12 IC60.12 IC61.12
N$348: IC58.13 IC59.13 IC60.13 IC61.13
N$349: IC58.14 IC59.14 IC60.14 IC61.14
N$350: IC58.15 IC59.15 IC60.15 IC61.15
N$351: IC58.16 IC59.16 IC60.16 IC61.16
N$352: IC58.17 IC59.17 IC60.17 IC61.17
N$353: IC58.18 IC59.18 IC60.18 IC61.18
N$354: IC58.19 IC59.19 IC60.19 IC61.19
N$355: IC58.20 IC59.20 IC60.20 IC61.20
N$356: IC58.21 IC59.21 IC60.21 IC61.21
N$357: IC58.22 IC59.22 IC60.22 IC61.22
N$358: IC58.23 IC59.23 IC60.23 IC61.23
N$359: IC58.24 IC59.24 IC60.24 IC61.24
N$360: IC62.1 IC63.1 IC64.1 IC65.1
N$361: IC62.2 IC63.2 IC64.2 IC65.2
N$362: IC62.3 IC63.3 IC64.3 IC65.3
N$363: IC62.4 IC63.4 IC64.4 IC65.4
N$364: IC62.5 IC63.5 IC64.5 IC65.5
N$365: IC62.6 IC63.6 IC64.6 IC65.6
N$366: IC62.7 IC63.7 IC64.7 IC65.7
N$367: IC62.8 IC63.8 IC64.8 IC65.8
N$368: IC62.9 IC63.9 IC64.9 IC65.9
N$369: IC62.10 IC63.10 IC64.10 IC65.10
N$370: IC62.11 IC63.11 IC64.11 IC65.11
N$371: IC62.12 IC63.12 IC64.12 IC65.12
N$372: IC62.13 IC63.13 IC64.13 IC65.13
N$373: IC62.14 IC63.14 IC64.14 IC65.14
N$374: IC62.15 IC63.15 IC64.15 IC65.15
N$375: IC62.16 IC63.16 IC64.16 IC65.16
N$376: IC62.17 IC63.17 IC64.17 IC65.17
N$377: IC62.18 IC63.18 IC64.18 IC65.18
N$378: IC62.19 IC63.19 IC64.19 IC65.19
N$379: IC62.20 IC63.20 IC64.20 IC65.20
N$380: IC62.21 IC63.21 IC64.21 IC65.21
N$381: IC62.22 IC63.22 IC64.22 IC65.22
N$382: IC62.23 IC63.23 IC64.23 IC65.23
N$383: IC62.24 IC63.24 IC64.24 IC65.24
N$384: IC66.1 IC67.1 IC68.1 IC69.1
N$385: IC66.2 IC67.2 IC68.2 IC69.2
N$386: IC66.3 IC67.3 IC68.3 IC69.3
N$387: IC66.4 IC67.4 IC68.4 IC69.4
N$388: IC66.5 IC67.5 IC68.5 IC69.5
N$389: IC66.6 IC67.6 IC68.6 IC69.6
N$390: IC66.7 IC67.7 IC68.7 IC69.7
N$391: IC66.8 IC67.8 IC68.8 IC69.8
N$392: IC66.9 IC67.9 IC68.9 IC69.9
N$393: IC66.10 IC67.10 IC68.10 IC69.10
N$394: IC66.11 IC67.11 IC68.11 IC69.11
N$395: IC66.12 IC67.12 IC68.12 IC69.12
N$396: IC66.13 IC67.13 IC68.13 IC69.13
N$397: IC66.14 IC67.14 IC68.14 IC69.14
N$398: IC66.15 IC67.15 IC68.15 IC69.15
N$399: IC66.16 IC67.16 IC68.16 IC69.16
N$400: IC66.17 IC67.17 IC68.17 IC69.17
N$401: IC66.18 IC67.18 IC68.18 IC69.18
N$402: IC66.19 IC67.19 IC68.19 IC69.19
N$403: IC66.20 IC67.20 IC68.20 IC69.20
N$404: IC66.21 IC67.21 IC68.21 IC69.21
N$405: IC66.22 IC67.22 IC68.22 IC69.22
N$406: IC66.23 IC67.23 IC68.23 IC69.23
N$407: IC66.24 IC67.24 IC68.24 IC69.24
N$408: IC70.1 IC71.1 IC72.1 IC73.1
N$409: IC70.2 IC71.2 IC72.2 IC73.2
N$410: IC70.3 IC71.3 IC72.3 IC73.3
N$411: IC70.4 IC71.4 IC72.4 IC73.4
N$412: IC70.5 IC71.5 IC72.5 IC73.5
N$413: IC70.6 IC71.6 IC72.6 IC73.6
N$414: IC70.7 IC71.7 IC72.7 IC73.7
N$415: IC70.8 IC71.8 IC72.8 IC73.8
N$416: IC70.9 IC71.9 IC72.9 IC73.9
N$417: IC70.10 IC71.10 IC72.10 IC73.10
N$418: IC70.11 IC71.11 IC72.11 IC73.11
N$419: IC70.12 IC71.12 IC72.12 IC73.12
N$420: IC70.13 IC71.13 IC72.13 IC73.13
N$421: IC70.14 IC71.14 IC72.14 IC73.14
N$422: IC70.15 IC71.15 IC72.15 IC73.15
N$423: IC70.16 IC71.16 IC72.16 IC73.16
N$424: IC70.17 IC71.17 IC72.17 IC73.17
N$425: IC70.18 IC71.18 IC72.18 IC73.18
N$426: IC70.19 IC71.19 IC72.19 IC73.19
N$427: IC70.20 IC71.20 IC72.20 IC73.20
N$428: IC70.21 IC71.21 IC72.21 IC73.21
N$429: IC70.22 IC71.22 IC72.22 IC73.22
N$430: IC70.23 IC71.23 IC72.23 IC73.23
N$431: IC70.24 IC71.24 IC72.24 IC73.24
N$432: IC74.1 IC75.1 IC76.1 IC77.1
N$433: IC74.2 IC75.2 IC76.2 IC77.2
N$434: IC74.3 IC75.3 IC76.3 IC77.3
N$435: IC74.4 IC75.4 IC76.4 IC77.4
N$436: IC74.5 IC75.5 IC76.5 IC77.5
N$437: IC74.6 IC75.6 IC76.6 IC77.6
N$438: IC74.7 IC75.7 IC76.7 IC77.7
N$439: IC74.8 IC75.8 IC76.8 IC77.8
N$440: IC74.9 IC75.9 IC76.9 IC77.9
N$441: IC74.10 IC75.10 IC76.10 IC77.10
N$442: IC74.11 IC75.11 IC76.11 IC77.11
N$443: IC74.12 IC75.12 IC76.12 IC77.12
N$444: IC74.13 IC75.13 IC76.13 IC77.13
N$445: IC74.14 IC75.14 IC76.14 IC77.14
N$446: IC74.15 IC75.15 IC76.15 IC77.15
N$447: IC74.16 IC75.16 IC76.16 IC77.16
N$448: IC74.17 IC75.17 IC76.17 IC77.17
N$449: IC74.18 IC75.18 IC76.18 IC77.18
N$450: IC74.19 IC75.19 IC76.19 IC77.19
N$451: IC74.20 IC75.20 IC76.20 IC77.20
N$452: IC74.21 IC75.21 IC76.21 IC77.21
N$453: IC74.22 IC75.22 IC76.22 IC77.22
N$454: IC74.23 IC75.23 IC76.23 IC77.23
N$455: IC74.24 IC75.24 IC76.24 IC77.24
N$456: IC78.1 IC79.1 IC80.1 IC81.1
N$457: IC78.2 IC79.2 IC80.2 IC81.2
N$458: IC78.3 IC79.3 IC80.3 IC81.3
N$459: IC78.4 IC79.4 IC80.4 IC81.4
N$460: IC78.5 IC79.5 IC80.5 IC81.5
N$461: IC78.6 IC79.6 IC80.6 IC81.6
N$462: IC78.7 IC79.7 IC80.7 IC81.7
N$463: IC78.8 IC79.8 IC80.8 IC81.8
N$464: IC78.9 IC79.9 IC80.9 IC81.9
N$465: IC78.10 IC79.10 IC80.10 IC81.10
N$466: IC78.11 IC79.11 IC80.11 IC81.11
N$467: IC78.12 IC79.12 IC80.12 IC81.12
N$468: IC78.13 IC79.13 IC80.13 IC81.13
N$469: IC78.14 IC79.14 IC80.14 IC81.14
N$470: IC78.15 IC79.15 IC80.15 IC81.15
N$471: IC78.16 IC79.16 IC80.16 IC81.16
N$472: IC78.17 IC79.17 IC80.17 IC81.17
N$473: IC78.18 IC79.18 IC80.18 IC81.18
N$474: IC78.19 IC79.19 IC80.19 IC81.19
N$475: IC78.20 IC79.20 IC80.20 IC81.20
N$476: IC78.21 IC79.21 IC80.21 IC81.21
N$477: IC78.22 IC79.22 IC80.22 IC81.22
N$478: IC78.23 IC79.23 IC80.23 IC81.23
N$479: IC78.24 IC79.24 IC80.24 IC81.24
N$480: IC82.1 IC83.1 IC84.1 IC85.1
N$481: IC82.2 IC83.2 IC84.2 IC85.2
N$482: IC82.3 IC83.3 IC84.3 IC85.3
N$483: IC82.4 IC83.4 IC84.4 IC85.4
N$484: IC82.5 IC83.5 IC84.5 IC85.5
N$485: IC82.6 IC83.6 IC84.6 IC85.6
N$486: IC82.7 IC83.7 IC84.7 IC85.7
N$487: IC82.8 IC83.8 IC84.8 IC85.8
N$488: IC82.9 IC83.9 IC84.9 IC85.9
N$489: IC82.10 IC83.10 IC84.10 IC85.10
N$490: IC82.11 IC83.11 IC84.11 IC85.11
N$491: IC82.12 IC83.12 IC84.12 IC85.12
N$492: IC82.13 IC83.13 IC84.13 IC85.13
N$493: IC82.14 IC83.14 IC84.14 IC85.14
N$494: IC82.15 IC83.15 IC84.15 IC85.15
N$495: IC82.16 IC83.16 IC84.16 IC85.16
N$496: IC82.17 IC83.17 IC84.17 IC85.17
N$497: IC82.18 IC83.18 IC84.18 IC85.18
N$498: IC82.19 IC83.19 IC84.19 IC85.19
N$499: IC82.20 IC83.20 IC84.20 IC85.20
N$500: IC82.21 IC83.21 IC84.21 IC85.21
N$501: IC82.22 IC83.22 IC84.22 IC85.22
N$502: IC82.23 IC83.23 IC84.23 IC85.23
N$503: IC82.24 IC83.24 IC84.24 IC85.24
N$504: IC86.1 IC87.1 IC88.1 IC89.1
N$505: IC86.2 IC87.2 IC88.2 IC89.2
N$506: IC86.3 IC87.3 IC88.3 IC89.3
N$507: IC86.4 IC87.4 IC88.4 IC89.4
N$508: IC86.5 IC87.5 IC88.5 IC89.5
N$509: IC86.6 IC87.6 IC88.6 IC89.6
N$510: IC86.7 IC87.7 IC88.7 IC89.7
N$511: IC86.8 IC87.8 IC88.8 IC89.8
N$512: IC86.9 IC87.9 IC88.9 IC89.9
N$513: IC86.10 IC87.10 IC88.10 IC89.10
N$514: IC86.11 IC87.11 IC88.11 IC89.11
N$515: IC86.12 IC87.12 IC88.12 IC89.12
N$516: IC86.13 IC87.13 IC88.13 IC89.13
N$517: IC86.14 IC87.14 IC88.14 IC89.14
N$518: IC86.15 IC87.15 IC88.15 IC89.15
N$519: IC86.16 IC87.16 IC88.16 IC89.16
N$520: IC86.17 IC87.17 IC88.17 IC89.17
N$521: IC86.18 IC87.18 IC88.18 IC89.18
N$522: IC86.19 IC87.19 IC88.19 IC89.19
N$523: IC86.20 IC87.20 IC88.20 IC89.20
N$524: IC86.21 IC87.21 IC88.21 IC89.21
N$525: IC86.22 IC87.22 IC88.22 IC89.22
N$526: IC86.23 IC87.23 IC88.23 IC89.23
N$527: IC86.24 IC87.24 IC88.24 IC89.24
N$528: IC90.1 IC91.1 IC92.1 IC93.1
N$529: IC90.2 IC91.2 IC92.2 IC93.2
N$530: IC90.3 IC91.3 IC92.3 IC93.3
N$531: IC90.4 IC91.4 IC92.4 IC93.4
N$532: IC90.5 IC91.5 IC92.5 IC93.5
N$533: IC90.6 IC91.6 IC92.6 IC93.6
N$534: IC90.7 IC91.7 IC92.7 IC93.7
N$535: IC90.8 IC91.8 IC92.8 IC93.8
N$536: IC90.9 IC91.9 IC92.9 IC93.9
N$537: IC90.10 IC91.10 IC92.10 IC93.10
N$538: IC90.11 IC91.11 IC92.11 IC93.11
N$539: IC90.12 IC91.12 IC92.12 IC93.12
N$540: IC90.13 IC91.13 IC92.13 IC93.13
N$541: IC90.14 IC91.14 IC92.14 IC93.14
N$542: IC90.15 IC91.15 IC92.15 IC93.15
N$543: IC90.16 IC91.16 IC92.16 IC93.16
N$544: IC90.17 IC91.17 IC92.17 IC93.17
N$545: IC90.18 IC91.18 IC92.18 IC93.18
N$546: IC90.19 IC91.19 IC92.19 IC93.19
N$547: IC90.20 IC91.20 IC92.20 IC93.20
N$548: IC90.21 IC91.21 IC92.21 IC93.21
N$549: IC90.22 IC91.22 IC92.22 IC93.22
N$550: IC90.23 IC91.23 IC92.23 IC93.23
N$551: IC90.24 IC91.24 IC92.24 IC93.24
N$552: IC94.1 IC95.1 IC96.1 IC97.1
N$553: IC94.2 IC95.2 IC96.2 IC97.2
N$554: IC94.3 IC95.3 IC96.3 IC97.3
N$555: IC94.4 IC95.4 IC96.4 IC97.4
N$556: IC94.5 IC95.5 IC96.5 IC97.5
N$557: IC94.6 IC95.6 IC96.6 IC97.6
N$558: IC94.7 IC95.7 IC96.7 IC97.7
N$559: IC94.8 IC95.8 IC96.8 IC97.8
N$560: IC94.9 IC95.9 IC96.9 IC97.9
N$561: IC94.10 IC95.10 IC96.10 IC97.10
N$562: IC94.11 IC95.11 IC96.11 IC97.11
N$563: IC94.12 IC95.12 IC96.12 IC97.12
N$564: IC94.13 IC95.13 IC96.13 IC97.13
N$565: IC94.14 IC95.14 IC96.14 IC97.14
N$566: IC94.15 IC95.15 IC96.15 IC97.15
N$567: IC94.16 IC95.16 IC96.16 IC97.16
N$568: IC94.17 IC95.17 IC96.17 IC97.17
N$569: IC94.18 IC95.18 IC96.18 IC97.18
N$570: IC94.19 IC95.19 IC96.19 IC97.19
N$571: IC94.20 IC95.20 IC96.20 IC97.20
N$572: IC94.21 IC95.21 IC96.21 IC97.21
N$573: IC94.22 IC95.22 IC96.22 IC97.22
N$574: IC94.23 IC95.23 IC96.23 IC97.23
N$575: IC94.24 IC95.24 IC96.24 IC97.24
N$576: IC98.1 IC99.1 IC100.1 IC101.1
N$577: IC98.2 IC99.2 IC100.2 IC101.2
N$578: IC98.3 IC99.3 IC100.3 IC101.3
N$579: IC98.4 IC99.4 IC100.4 IC101.4
N$580: IC98.5 IC99.5 IC100.5 IC101.5
N$581: IC98.6 IC99.6 IC100.6 IC101.6
N$582: IC98.7 IC99.7 IC100.7 IC101.7
N$583: IC98.8 IC99.8 IC100.8 IC101.8
N$584: IC98.9 IC99.9 IC100.9 IC101.9
N$585: IC98.10 IC99.10 IC100.10 IC101.10
N$586: IC98.11 IC99.11 IC100.11 IC101.11
N$587: IC98.12 IC99.12 IC100.12 IC101.12
N$588: IC98.13 IC99.13 IC100.13 IC101.13
N$589: IC98.14 IC99.14 IC100.14 IC101.14
N$590: IC98.15 IC99.15 IC100.15 IC101.15
N$591: IC98.16 IC99.16 IC100.16 IC101.16
N$592: IC98.17 IC99.17 IC100.17 IC101.17
N$593: IC98.18 IC99.18 IC100.18 IC101.18
N$594: IC98.19 IC99.19 IC100.19 IC101.19
N$595: IC98.20 IC99.20 IC100.20 IC101.20
N$596: IC98.21 IC99.21 IC100.21 IC101.21
N$597: IC98.22 IC99.22 IC100.22 IC101.22
N$598: IC98.23 IC99.23 IC100.23 IC101.23
N$599: IC98.24 IC99.24 IC100.24 IC101.24
N$600: IC102.1 IC103.1 IC104.1 IC105.1
N$601: IC102.2 IC103.2 IC104.2 IC105.2
N$602: IC102.3 IC103.3 IC104.3 IC105.3
N$603: IC102.4 IC103.4 IC104.4 IC105.4
N$604: IC102.5 IC103.5 IC104.5 IC105.5
N$605: IC102.6 IC103.6 IC104.6 IC105.6
N$606: IC102.7 IC103.7 IC104.7 IC105.7
N$607: IC102.8 IC103.8 IC104.8 IC105.8
N$608: IC102.9 IC103.9 IC104.9 IC105.9
N$609: IC102.10 IC103.10 IC104.10 IC105.10
N$610: IC102.11 IC103.11 IC104.11 IC105.11
N$611: IC102.12 IC103.12 IC104.12 IC105.12
N$612: IC102.13 IC103.13 IC104.13 IC105.13
N$613: IC102.14 IC103.14 IC104.14 IC105.14
N$614: IC102.15 IC103.15 IC104.15 IC105.15
N$615: IC102.16 IC103.16 IC104.16 IC105.16
N$616: IC102.17 IC103.17 IC104.17 IC105.17
N$617: IC102.18 IC103.18 IC104.18 IC105.18
N$618: IC102.19 IC103.19 IC104.19 IC105.19
N$619: IC102.20 IC103.20 IC104.20 IC105.20
N$620: IC102.21 IC103.21 IC104.21 IC105.21
N$621: IC102.22 IC103.22 IC104.22 IC105.22
N$622: IC102.23 IC103.23 IC104.23 IC105.23
N$623: IC102.24 IC103.24 IC104.24 IC105.24
N$624: IC106.1 IC107.1 IC108.1 IC109.1
N$625: IC106.2 IC107.2 IC108.2 IC109.2
N$626: IC106.3 IC107.3 IC108.3 IC109.3
N$627: IC106.4 IC107.4 IC108.4 IC109.4
N$628: IC106.5 IC107.5 IC108.5 IC109.5
N$629: IC106.6 IC107.6 IC108.6 IC109.6
N$630: IC106.7 IC107.7 IC108.7 IC109.7
N$631: IC106.8 IC107.8 IC108.8 IC109.8
N$632: IC106.9 IC107.9 IC108.9 IC109.9
N$633: IC106.10 IC107.10 IC108.10 IC109.10
N$634: IC106.11 IC107.11 IC108.11 IC109.11
N$635: IC106.12 IC107.12 IC108.12 IC109.12
N$636: IC106.13 IC107.13 IC108.13 IC109.13
N$637: IC106.14 IC107.14 IC108.14 IC109.14
N$638: IC106.15 IC107.15 IC108.15 IC109.15
N$639: IC106.16 IC107.16 IC108.16 IC109.16
N$640: IC106.17 IC107.17 IC108.17 IC109.17
N$641: IC106.18 IC107.18 IC108.18 IC109.18
N$642: IC106.19 IC107.19 IC108.19 IC109.19
N$643: IC106.20 IC107.20 IC108.20 IC109.20
N$644: IC106.21 IC107.21 IC108.21 IC109.21
N$645: IC106.22 IC107.22 IC108.22 IC109.22
N$646: IC106.23 IC107.23 IC108.23 IC109.23
N$647: IC106.24 IC107.24 IC108.24 IC109.24
VCC [supply]: C1.+ C2.+ SV1.1 SV1.2 SV1.3 SV1.4 SV1.5 SV1.6 SV1.7 SV1.8 SV1.9 SV1.10 SV1.11 SV1.12 SV3.1 SV3.2 SV3.3 SV3.4 SV3.5 SV3.6 SV3.7 SV3.8 SV3.9 SV3.10 SV3.11 SV3.12 SV5.1 SV5.2 SV5.3 SV5.4 SV5.5 SV5.6 SV5.7 SV5.8 SV5.9 SV5.10 SV5.11 SV5.12 SV7.1 SV7.2 SV7.3 SV7.4 SV7.5 SV7.6 SV7.7 SV7.8 SV7.9 SV7.10 SV7.11 SV7.12 SV9.1 SV9.2 SV9.3 SV9.4 SV9.5 SV9.6 SV9.7 SV9.8 SV9.9 SV9.10 SV9.11 SV9.12 SV11.1 SV11.2 SV11.3 SV11.4 SV11.5 SV11.6 SV11.7 SV11.8 SV11.9 SV11.10 SV11.11 SV11.12 SV13.1 SV13.2 SV13.3 SV13.4 SV13.5 SV13.6 SV13.7 SV13.8 SV13.9 SV13.10 SV13.11 SV13.12 SV15.1 SV15.2 SV15.3 SV15.4 SV15.5 SV15.6 SV15.7 SV15.8 SV15.9 SV15.10 SV15.11 SV15.12 SV17.1 SV17.2 SV17.3 SV17.4 SV17.5 SV17.6 SV17.7 SV17.8 SV17.9 SV17.10 SV17.11 SV17.12 SV19.1 SV19.2 SV19.3 SV19.4 SV19.5 SV19.6 SV19.7 SV19.8 SV19.9 SV19.10 SV19.11 SV19.12 SV21.1 SV21.2 SV21.3 SV21.4 SV21.5 SV21.6 SV21.7 SV21.8 SV21.9 SV21.10 SV21.11 SV21.12 SV23.1 SV23.2 SV23.3 SV23.4 SV23.5 SV23.6 SV23.7 SV23.8 SV23.9 SV23.10 SV23.11 SV23.12 SV25.1 SV25.2 SV25.3 SV25.4 SV25.5 SV25.6 SV25.7 SV25.8 SV25.9 SV25.10 SV25.11 SV25.12 SV27.1 SV27.2 SV27.3 SV27.4 SV27.5 SV27.6 SV27.7 SV27.8 SV27.9 SV27.10 SV27.11 SV27.12 SV29.1 SV29.2 SV29.3 SV29.4 SV29.5 SV29.6 SV29.7 SV29.8 SV29.9 SV29.10 SV29.11 SV29.12 SV31.1 SV31.2 SV31.3 SV31.4 SV31.5 SV31.6 SV31.7 SV31.8 SV31.9 SV31.10 SV31.11 SV31.12 SV33.1 SV33.2 SV33.3 SV33.4 SV33.5 SV33.6 SV33.7 SV33.8 SV33.9 SV33.10 SV33.11 SV33.12 SV35.1 SV35.2 SV35.3 SV35.4 SV35.5 SV35.6 SV35.7 SV35.8 SV35.9 SV35.10 SV35.11 SV35.12 SV37.1 SV37.2 SV37.3 SV37.4 SV37.5 SV37.6 SV37.7 SV37.8 SV37.9 SV37.10 SV37.11 SV37.12 SV39.1 SV39.2 SV39.3 SV39.4 SV39.5 SV39.6 SV39.7 SV39.8 SV39.9 SV39.10 SV39.11 SV39.12 SV183.1 SV183.2 SV183.3 SV183.4 SV183.5 SV183.6 SV183.7 SV183.8 SV183.9 SV183.10 SV183.11 SV183.12 SV185.1 SV185.2 SV185.3 SV185.4 SV185.5 SV185.6 SV185.7 SV185.8 SV185.9 SV185.10 SV185.11 SV185.12 SV187.1 SV187.2 SV187.3 SV187.4 SV187.5 SV187.6 SV187.7 SV187.8 SV187.9 SV187.10 SV187.11 SV187.12 SV189.1 SV189.2 SV189.3 SV189.4 SV189.5 SV189.6 SV189.7 SV189.8 SV189.9 SV189.10 SV189.11 SV189.12 SV191.1 SV191.2 SV191.3 SV191.4 SV191.5 SV191.6 SV191.7 SV191.8 SV191.9 SV191.10 SV191.11 SV191.12 ; also sheet 1,3

### Notes on the sheet
- General Prototyping Areas
- 1